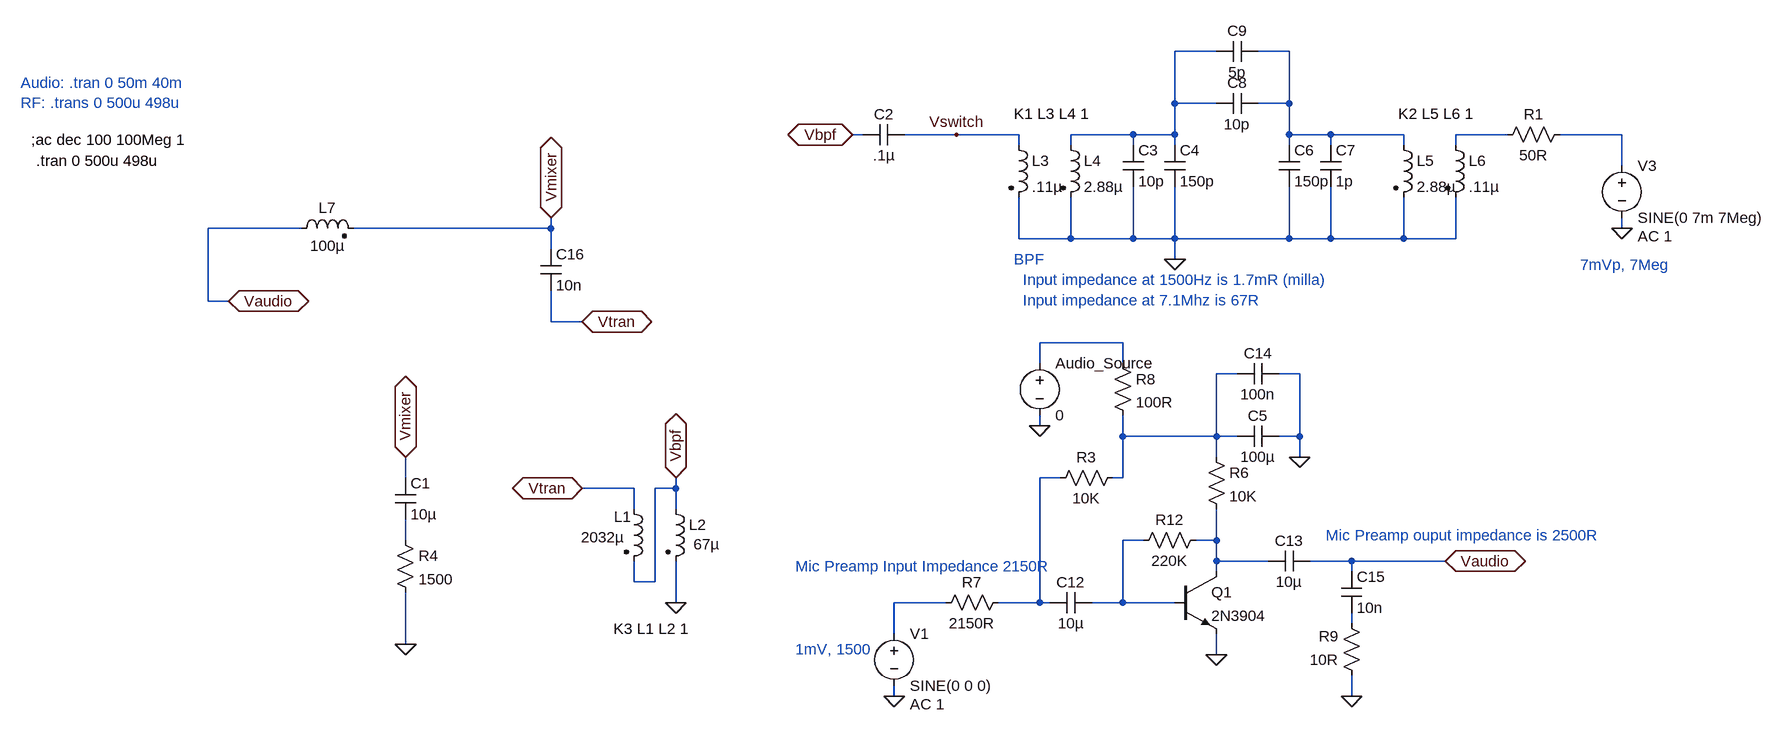
[diagram p0: schematic Receive Chain Passive Switch Test.asc]
Receive Chain Passive Switch Test.asc, the LTspice schematic file:
Version 4
SHEET 1 2548 2196
WIRE 928 -16 864 -16
WIRE 1040 -16 992 -16
WIRE 864 64 864 -16
WIRE 928 64 864 64
WIRE 1040 64 1040 -16
WIRE 1040 64 992 64
WIRE 384 112 368 112
WIRE 528 112 448 112
WIRE 624 112 528 112
WIRE 800 112 704 112
WIRE 864 112 864 64
WIRE 864 112 800 112
WIRE 1040 112 1040 64
WIRE 1104 112 1040 112
WIRE 1216 112 1104 112
WIRE 1376 112 1296 112
WIRE 1552 112 1456 112
WIRE 624 128 624 112
WIRE 704 128 704 112
WIRE 800 128 800 112
WIRE 864 128 864 112
WIRE 1040 128 1040 112
WIRE 1104 128 1104 112
WIRE 1216 128 1216 112
WIRE 1296 128 1296 112
WIRE 1552 160 1552 112
WIRE -480 256 -624 256
WIRE -96 256 -96 240
WIRE -96 256 -400 256
WIRE 1552 256 1552 240
WIRE 624 272 624 208
WIRE 704 272 704 208
WIRE 704 272 624 272
WIRE 800 272 800 192
WIRE 800 272 704 272
WIRE 864 272 864 192
WIRE 864 272 800 272
WIRE 1040 272 1040 192
WIRE 1040 272 864 272
WIRE 1104 272 1104 192
WIRE 1104 272 1040 272
WIRE 1216 272 1216 208
WIRE 1216 272 1104 272
WIRE 1296 272 1296 208
WIRE 1296 272 1216 272
WIRE -96 288 -96 256
WIRE 864 304 864 272
WIRE -624 368 -624 256
WIRE -592 368 -624 368
WIRE -96 400 -96 352
WIRE -48 400 -96 400
WIRE 784 432 656 432
WIRE 656 464 656 432
WIRE 784 464 784 432
WIRE 960 480 928 480
WIRE 1056 480 1024 480
WIRE 656 560 656 544
WIRE 784 576 784 544
WIRE 928 576 928 480
WIRE 928 576 784 576
WIRE 960 576 928 576
WIRE 1056 576 1056 480
WIRE 1056 576 1024 576
WIRE 928 608 928 576
WIRE 1056 608 1056 576
WIRE -320 640 -320 608
WIRE 688 640 656 640
WIRE 784 640 784 576
WIRE 784 640 768 640
WIRE 32 656 -48 656
WIRE 96 656 96 640
WIRE 96 656 64 656
WIRE 32 688 32 656
WIRE 96 688 96 656
WIRE -320 736 -320 704
WIRE 816 736 784 736
WIRE 928 736 928 688
WIRE 928 736 896 736
WIRE 928 768 928 736
WIRE 1008 768 928 768
WIRE 1136 768 1072 768
WIRE 1280 768 1136 768
WIRE 928 784 928 768
WIRE 1136 784 1136 768
WIRE 32 800 32 768
WIRE 64 800 64 656
WIRE 64 800 32 800
WIRE 96 832 96 768
WIRE 512 832 432 832
WIRE 656 832 656 640
WIRE 656 832 592 832
WIRE 672 832 656 832
WIRE 784 832 784 736
WIRE 784 832 736 832
WIRE 864 832 784 832
WIRE 1136 864 1136 848
WIRE 432 880 432 832
WIRE -320 896 -320 816
WIRE 928 912 928 880
WIRE 432 976 432 960
WIRE 1136 976 1136 944
FLAG 96 640 Vbpf
IOPIN 96 640 BiDir
FLAG -320 896 0
FLAG 528 112 Vswitch
FLAG 368 112 Vbpf
IOPIN 368 112 BiDir
FLAG 1280 768 Vaudio
IOPIN 1280 768 BiDir
FLAG 96 832 0
FLAG -592 368 Vaudio
IOPIN -592 368 BiDir
FLAG -320 608 Vmixer
IOPIN -320 608 BiDir
FLAG -96 240 Vmixer
IOPIN -96 240 BiDir
FLAG -48 656 Vtran
IOPIN -48 656 BiDir
FLAG -48 400 Vtran
IOPIN -48 400 BiDir
FLAG 656 560 0
FLAG 432 976 0
FLAG 928 912 0
FLAG 1056 608 0
FLAG 1136 976 0
FLAG 864 304 0
FLAG 1552 256 0
SYMBOL cap 448 96 R90
WINDOW 0 0 32 VBottom 2
WINDOW 3 32 32 VTop 2
SYMATTR InstName C2
SYMATTR Value .1µ
SYMBOL res -336 720 R0
SYMATTR InstName R4
SYMATTR Value 1500
SYMBOL ind2 16 672 R0
WINDOW 0 -15 28 Left 2
WINDOW 3 -66 59 Left 2
SYMATTR InstName L1
SYMATTR Value 2032µ
SYMATTR Type ind
SYMBOL ind2 80 672 R0
WINDOW 3 43 70 Left 2
SYMATTR Value 67µ
SYMATTR InstName L2
SYMATTR Type ind
SYMBOL cap -336 640 R0
SYMATTR InstName C1
SYMATTR Value 10µ
SYMBOL ind2 -496 272 R270
WINDOW 0 32 56 VTop 2
WINDOW 3 5 56 VBottom 2
SYMATTR InstName L7
SYMATTR Value 100µ
SYMATTR Type ind
SYMBOL npn 864 784 R0
SYMATTR InstName Q1
SYMATTR Value 2N3904
SYMBOL res 784 624 R90
WINDOW 0 0 56 VBottom 2
WINDOW 3 32 56 VTop 2
SYMATTR InstName R3
SYMATTR Value 10K
SYMBOL res 912 592 R0
SYMATTR InstName R6
SYMATTR Value 10K
SYMBOL cap 1024 560 R90
WINDOW 0 0 32 VBottom 2
WINDOW 3 32 32 VTop 2
SYMATTR InstName C5
SYMATTR Value 100µ
SYMBOL cap 736 816 R90
WINDOW 0 0 32 VBottom 2
WINDOW 3 32 32 VTop 2
SYMATTR InstName C12
SYMATTR Value 10µ
SYMBOL voltage 432 864 R0
WINDOW 123 24 124 Left 2
WINDOW 39 0 0 Left 2
SYMATTR Value2 AC 1
SYMATTR InstName V1
SYMATTR Value SINE(0 0 0)
SYMBOL voltage 656 448 R0
WINDOW 123 0 0 Left 2
WINDOW 39 0 0 Left 2
SYMATTR InstName Audio_Source
SYMATTR Value 0
SYMBOL res 608 816 R90
WINDOW 0 0 56 VBottom 2
WINDOW 3 32 56 VTop 2
SYMATTR InstName R7
SYMATTR Value 2150R
SYMBOL res 768 448 R0
SYMATTR InstName R8
SYMATTR Value 100R
SYMBOL cap 1072 752 R90
WINDOW 0 0 32 VBottom 2
WINDOW 3 32 32 VTop 2
SYMATTR InstName C13
SYMATTR Value 10µ
SYMBOL res 1152 960 R180
WINDOW 0 36 76 Left 2
WINDOW 3 36 40 Left 2
SYMATTR InstName R9
SYMATTR Value 10R
SYMBOL cap 1024 464 R90
WINDOW 0 0 32 VBottom 2
WINDOW 3 32 32 VTop 2
SYMATTR InstName C14
SYMATTR Value 100n
SYMBOL res 912 720 R90
WINDOW 0 0 56 VBottom 2
WINDOW 3 32 56 VTop 2
SYMATTR InstName R12
SYMATTR Value 220K
SYMBOL cap 1120 784 R0
SYMATTR InstName C15
SYMATTR Value 10n
SYMBOL cap -112 288 R0
SYMATTR InstName C16
SYMATTR Value 10n
SYMBOL cap 784 128 R0
SYMATTR InstName C3
SYMATTR Value 10p
SYMBOL cap 848 128 R0
SYMATTR InstName C4
SYMATTR Value 150p
SYMBOL cap 1024 128 R0
SYMATTR InstName C6
SYMATTR Value 150p
SYMBOL cap 1088 128 R0
SYMATTR InstName C7
SYMATTR Value 1p
SYMBOL cap 992 48 R90
WINDOW 0 0 32 VBottom 2
WINDOW 3 32 32 VTop 2
SYMATTR InstName C8
SYMATTR Value 10p
SYMBOL cap 992 -32 R90
WINDOW 0 0 32 VBottom 2
WINDOW 3 32 32 VTop 2
SYMATTR InstName C9
SYMATTR Value 5p
SYMBOL ind2 608 112 R0
SYMATTR InstName L3
SYMATTR Value .11µ
SYMATTR Type ind
SYMBOL ind2 688 112 R0
SYMATTR InstName L4
SYMATTR Value 2.88µ
SYMATTR Type ind
SYMBOL ind2 1200 112 R0
SYMATTR InstName L5
SYMATTR Value 2.88µ
SYMATTR Type ind
SYMBOL ind2 1280 112 R0
SYMATTR InstName L6
SYMATTR Value .11µ
SYMATTR Type ind
SYMBOL voltage 1552 144 R0
WINDOW 123 24 124 Left 2
WINDOW 39 0 0 Left 2
SYMATTR Value2 AC 1
SYMATTR InstName V3
SYMATTR Value SINE(0 7m 7Meg)
SYMBOL res 1360 128 R270
WINDOW 0 32 56 VTop 2
WINDOW 3 0 56 VBottom 2
SYMATTR InstName R1
SYMATTR Value 50R
TEXT -888 152 Left 2 !.tran 0 500u 498u
TEXT -896 120 Left 2 !;ac dec 100 100Meg 1
TEXT 0 872 Left 2 !K3 L1 L2 1
TEXT 280 776 Left 2 ;Mic Preamp Input Impedance 2150R
TEXT 1096 728 Left 2 ;Mic Preamp ouput impedance is 2500R
TEXT 280 904 Left 2 ;1mV, 1500
TEXT -912 32 Left 2 ;Audio: .tran 0 50m 40m\nRF: .trans 0 500u 498u
TEXT 616 80 Left 2 !K1 L3 L4 1
TEXT 1208 80 Left 2 !K2 L5 L6 1
TEXT 616 304 Left 2 ;BPF\n  Input impedance at 1500Hz is 1.7mR (milla)\n  Input impedance at 7.1Mhz is 67R
TEXT 1488 312 Left 2 ;7mVp, 7Meg

The netlist it stands for:
* Receive Chain Passive Switch Test.asc
C2 Vswitch Vbpf .1µ
R4 N008 0 1500
L1 Vtran Vbpf 2032µ
L2 Vbpf 0 67µ
C1 Vmixer N008 10µ
L7 Vaudio Vmixer 100µ
Q1 N010 N009 0 0 2N3904
R3 N006 N007 10K
R6 N006 N010 10K
C5 0 N006 100µ
C12 N009 N007 10µ
V1 N011 0 SINE(0 0 0) AC 1
V§Audio_Source N005 0 0
R7 N007 N011 2150R
R8 N005 N006 100R
C13 Vaudio N010 10µ
R9 0 N012 10R
C14 0 N006 100n
R12 N010 N009 220K
C15 Vaudio N012 10n
C16 Vmixer Vtran 10n
C3 N001 0 10p
C4 N001 0 150p
C6 N002 0 150p
C7 N002 0 1p
C8 N002 N001 10p
C9 N002 N001 5p
L3 Vswitch 0 .11µ
L4 N001 0 2.88µ
L5 N002 0 2.88µ
L6 N003 0 .11µ
V3 N004 0 SINE(0 7m 7Meg) AC 1
R1 N003 N004 50R
.model NPN NPN
.model PNP PNP
.lib standard.bjt
.tran 0 500u 498u
;ac dec 100 100Meg 1
K3 L1 L2 1
* Mic Preamp Input Impedance 2150R
* Mic Preamp ouput impedance is 2500R
* 1mV, 1500
* Audio: .tran 0 50m 40m
* RF: .trans 0 500u 498u
K1 L3 L4 1
K2 L5 L6 1
* BPF
*   Input impedance at 1500Hz is 1.7mR (milla)
*   Input impedance at 7.1Mhz is 67R
* 7mVp, 7Meg
.backanno
.end